# EAGLE design four-step-octaved (EAGLE 9.6.2)
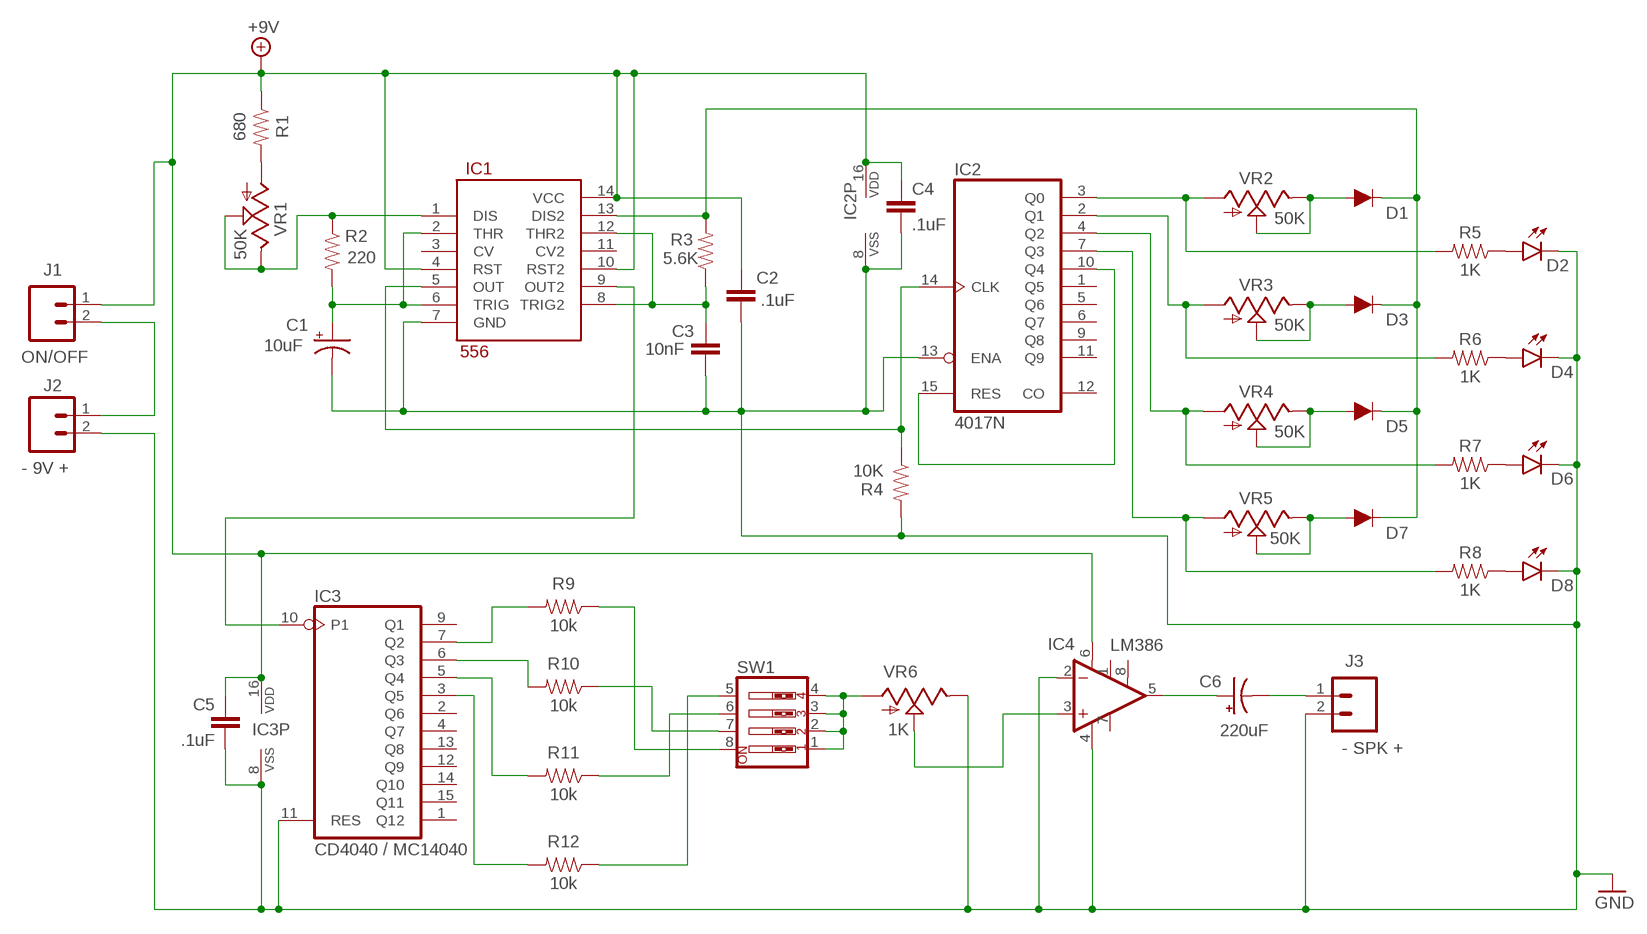
[diagram p0: schematic, sheet 1]

## Parts
C1  10uF  10UF-POLAR-RADIAL-2.5MM-25V-20%  [CPOL-RADIAL-2.5MM-5MM]
C2  .1uF  0.1UF-KIT-EZ-50V-20%  [CAP-PTH-SMALL-KIT]
C3  10nF  0.1UF-KIT-EZ-50V-20%  [CAP-PTH-SMALL-KIT]
C4  .1uF  0.1UF-KIT-EZ-50V-20%  [CAP-PTH-SMALL-KIT]
C5  .1uF  0.1UF-KIT-EZ-50V-20%  [CAP-PTH-SMALL-KIT]
C6  220uF  10UF-POLAR-RADIAL-2.5MM-25V-20%  [CPOL-RADIAL-2.5MM-5MM]
D1  DIODE-PTH  [DIODE-1N4001]
D2  LED3MM  [LED_3MM]
D3  DIODE-PTH  [DIODE-1N4001]
D4  LED3MM  [LED_3MM]
D5  DIODE-PTH  [DIODE-1N4001]
D6  LED3MM  [LED_3MM]
D7  DIODE-PTH  [DIODE-1N4001]
D8  LED3MM  [LED_3MM]
IC1  556  [DIP14]
IC2  4017N  [DIL16]
IC3  CD4040 / MC14040  4040N  [DIL16]
IC4  LM386  [DIP08]
J1  ON/OFF  CONN_02  [1X02]
J2  - 9V +  CONN_02  [1X02]
J3  - SPK +  CONN_02  [1X02]
R1  680  1KOHM-HORIZ-1/4W-1%  [AXIAL-0.3]
R2  220  1KOHM-HORIZ-1/4W-1%  [AXIAL-0.3]
R3  5.6K  1KOHM-HORIZ-1/4W-1%  [AXIAL-0.3]
R4  10K  1KOHM-HORIZ-1/4W-1%  [AXIAL-0.3]
R5  1K  1KOHM-HORIZ-1/4W-1%  [AXIAL-0.3]
R6  1K  1KOHM-HORIZ-1/4W-1%  [AXIAL-0.3]
R7  1K  1KOHM-HORIZ-1/4W-1%  [AXIAL-0.3]
R8  1K  1KOHM-HORIZ-1/4W-1%  [AXIAL-0.3]
R9  10k  1KOHM-HORIZ-1/4W-1%  [AXIAL-0.3]
R10  10k  1KOHM-HORIZ-1/4W-1%  [AXIAL-0.3]
R11  10k  1KOHM-HORIZ-1/4W-1%  [AXIAL-0.3]
R12  10k  1KOHM-HORIZ-1/4W-1%  [AXIAL-0.3]
SW1  SW_DIP-4  [EDG-04]
VR1  50K  POTTRIM  [TRIM_POT]
VR2  50K  POTTRIM  [TRIM_POT]
VR3  50K  POTTRIM  [TRIM_POT]
VR4  50K  POTTRIM  [TRIM_POT]
VR5  50K  POTTRIM  [TRIM_POT]
VR6  1K  POTTRIM  [TRIM_POT]

## Nets
+9V [supply]: C2.1 C4.1 C5.1 IC1.4(RST) IC1.10(RST2) IC1.14(VCC) IC2.16(VDD) IC3.16(VDD) IC4.6(V+) J1.1 R1.P$1
GND [supply]: C1.2(-) C2.2 C3.2 C4.2 C5.2 D2.K(C) D4.K(C) D6.K(C) D8.K(C) IC1.7(GND) IC2.8(VSS) IC2.13(ENA) IC3.8(VSS) IC3.11(RES) IC4.2(-IN) IC4.4(V-) J2.2 J3.2 R4.P$2 VR6.2(E)
N$1 [new default]: R1.P$2 VR1.3(A)
N$2 [new default]: IC1.1(DIS) R2.P$1 VR1.1(S) VR1.2(E)
N$3 [new default]: C1.1(+) IC1.2(THR) IC1.6(TRIG) R2.P$2
N$4 [new default]: IC2.10(Q4) IC2.15(RES)
N$5 [new default]: IC1.5(OUT) IC2.14(CLK) R4.P$1
N$6 [new default]: C3.1 IC1.8(TRIG2) IC1.12(THR2) R3.P$1
N$7 [new default]: IC2.3(Q0) R5.P$2 VR2.3(A)
N$8 [new default]: IC2.2(Q1) R6.P$2 VR3.3(A)
N$9 [new default]: IC2.4(Q2) R7.P$2 VR4.3(A)
N$10 [new default]: IC2.7(Q3) R8.P$2 VR5.3(A)
N$11 [new default]: D1.A VR2.1(S) VR2.2(E)
N$12 [new default]: D8.A R8.P$1
N$13 [new default]: D6.A R7.P$1
N$14 [new default]: D4.A R6.P$1
N$15 [new default]: D2.A R5.P$1
N$16 [new default]: D3.A VR3.1(S) VR3.2(E)
N$17 [new default]: D5.A VR4.1(S) VR4.2(E)
N$18 [new default]: D7.A VR5.1(S) VR5.2(E)
N$19 [new default]: D1.C D3.C D5.C D7.C IC1.13(DIS2) R3.P$2
N$20 [new default]: IC3.7(Q2) R9.P$2
N$21: IC3.5(Q4) R11.P$2
N$22 [new default]: IC3.6(Q3) R10.P$2
N$23: R12.P$1 SW1.5
N$24 [new default]: IC4.3(+IN) VR6.1(S)
N$25: IC3.3(Q5) R12.P$2
N$26: R11.P$1 SW1.6
N$27 [new default]: C6.2(-) J3.1
N$28 [new default]: C6.1(+) IC4.5(OUT)
N$29: R10.P$1 SW1.7
N$30: R9.P$1 SW1.8
N$31: SW1.1 SW1.2 SW1.3 SW1.4 VR6.3(A)
N$32: J1.2 J2.1
N$43 [new default]: IC1.9(OUT2) IC3.10(P1)
Unconnected: IC1.3(CV) IC1.11(CV2) IC2.1(Q5) IC2.5(Q6) IC2.6(Q7) IC2.9(Q8) IC2.11(Q9) IC2.12(CO) IC3.1(Q12) IC3.2(Q6) IC3.4(Q7) IC3.9(Q1) IC3.12(Q9) IC3.13(Q8) IC3.14(Q10) IC3.15(Q11) IC4.1(GAIN) IC4.7(BP) IC4.8(GAIN)

## Library data of the parts
C1 = SparkFun-Capacitors:10UF-POLAR: 10.0µF polarized capacitors A capacitor is a passive two-terminal electrical component used to store electrical energy temporarily in an electric field.; PROD_ID: CAP-08440
C2-C5 = SparkFun-Capacitors:0.1UF: 0.1µF ceramic capacitors A capacitor is a passive two-terminal electrical component used to store electrical energy temporarily in an electric field.; PROD_ID: CAP-08370; VALUE: 0.1uF
C6 = SparkFun-Capacitors:10UF-POLAR: 10.0µF polarized capacitors A capacitor is a passive two-terminal electrical component used to store electrical energy temporarily in an electric field.; PROD_ID: CAP-08440; VALUE: 10uF
D1 D3 D5 D7 = SparkFun-DiscreteSemi:DIODE: Diode These are standard reverse protection diodes and small signal diodes. SparkFun Products: SparkFun SparkPunk Sound Kit <https://www.sparkfun.com/products/11177> SparkFun ESP8266 Thing <https://www.sparkfun.com/products/13231>; PROD_ID: DIO-09176; VALUE: 1A/50V/1.1V
D2 D4 D6 D8 = SparkFun-LED:LED: LED (Generic) Standard schematic elements and footprints for 5mm, 3mm, 1206, and 0603 sized LEDs. Generic LEDs with no color specified.; PROD_ID: DIO-08794
IC1 = SparkFun-IC-Special-Function:556: 556 Dual 555 timer 2 555 timers in one package 1MHZ 14DIP Datasheet <https://cdn.sparkfun.com/datasheets/Kits/icm7555-56.pdf> SparkFun Products SparkFun SparkPunk Sound Kit <https://www.sparkfun.com/products/11177> (KIT-11177); PROD_ID: IC-11898
IC2 = 40xx:4017: COUNTER/DIVIDER
IC3 = 40xx:4040: 12-stage binary/ripple COUNTER
IC4 = SparkFun-IC-Amplifiers:LM386: low voltage audio power amplifier SparkFun Products FabFM Radio Kit <https://www.sparkfun.com/products/11043> (KIT-11043); PROD_ID: IC-10899; VALUE: LM386N
J1-J3 = SparkFun-Connectors:CONN_02: Multi connection point. Often used as Generic Header-pin footprint for 0.1 inch spaced/style header connections On any of the 0.1 inch spaced packages, you can populate with these: Break Away Headers - Straight <https://www.sparkfun.com/products/116> (PRT-00116) Break Away Male Headers - Right Angle <https://www.sparkfun.com/products/553> (PRT-00553) Female Headers <https://www.sparkfun.com/products/115> (PRT-00115) Break Away Headers - Machine Pin <https://www.sparkfun.com/products/117> (PRT-00117) Break Away Female Headers - Swiss Machine Pin <https://www.sparkfun.com/products/743> (PRT-00743) For SCREWTERMINALS and SPRING TERMINALS visit here: Screw Terimnals on SparkFun.com <https://www.sparkfun.com/search/results?term=Screw+Terminals> (5mm/3.5mm/2.54mm spacing) This device is also useful as a general connection point to wire up your design to another part of your project. Our various solder wires solder well into these plated through hole pads. Hook-Up Wire - Assortment (Stranded, 22 AWG) <https://www.sparkfun.com/products/11375> (PRT-11375) Hook-Up Wire - Assortment (Solid Core, 22 AWG) <https://www.sparkfun.com/products/11367> (PRT-11367) View the entire wire category on our website here <https://www.sparkfun.com/categories/141> Special notes: Molex polarized connector foot print use with: PRT-08233 with associated crimp pins and housings. 2.54_SCREWTERM for use with PRT-10571. 3.5mm Screw Terminal footprints for PRT-08084 5mm Screw Terminal footprints for use with PRT-08432
R1-R12 = SparkFun-Resistors:1KOHM: 1kΩ resistor A resistor is a passive two-terminal electrical component that implements electrical resistance as a circuit element. Resistors act to reduce current flow, and, at the same time, act to lower voltage levels within circuits. - Wikipedia; PROD_ID: RES-12182; VALUE: 1k
SW1 = special:SW_DIP-4: DIP SWITCH
VR1-VR6 = SparkFun-Retired:POT; PROD_ID: COM-00104

## Net classes
1 new default: width 0.254 mm, clearance 0.254 mm
2 supply: width 0.508 mm, clearance 0.508 mm

## Board
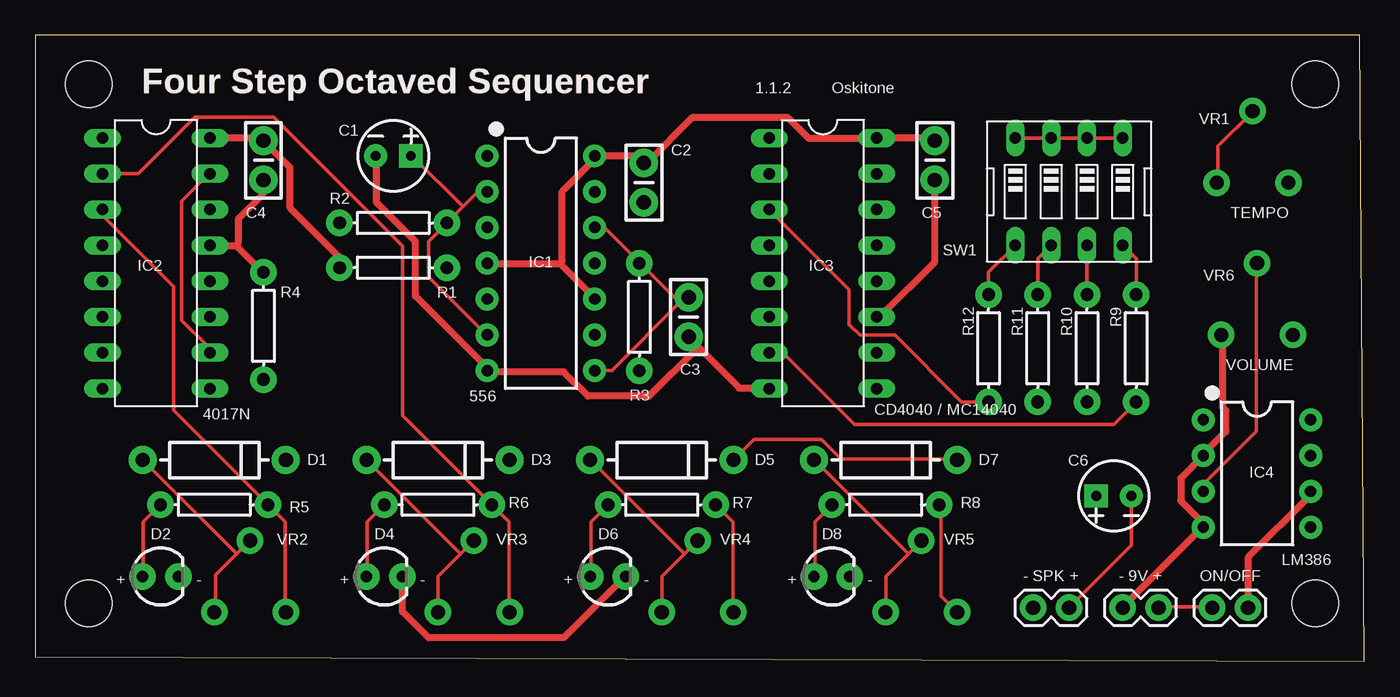
[diagram p1: board, top side]
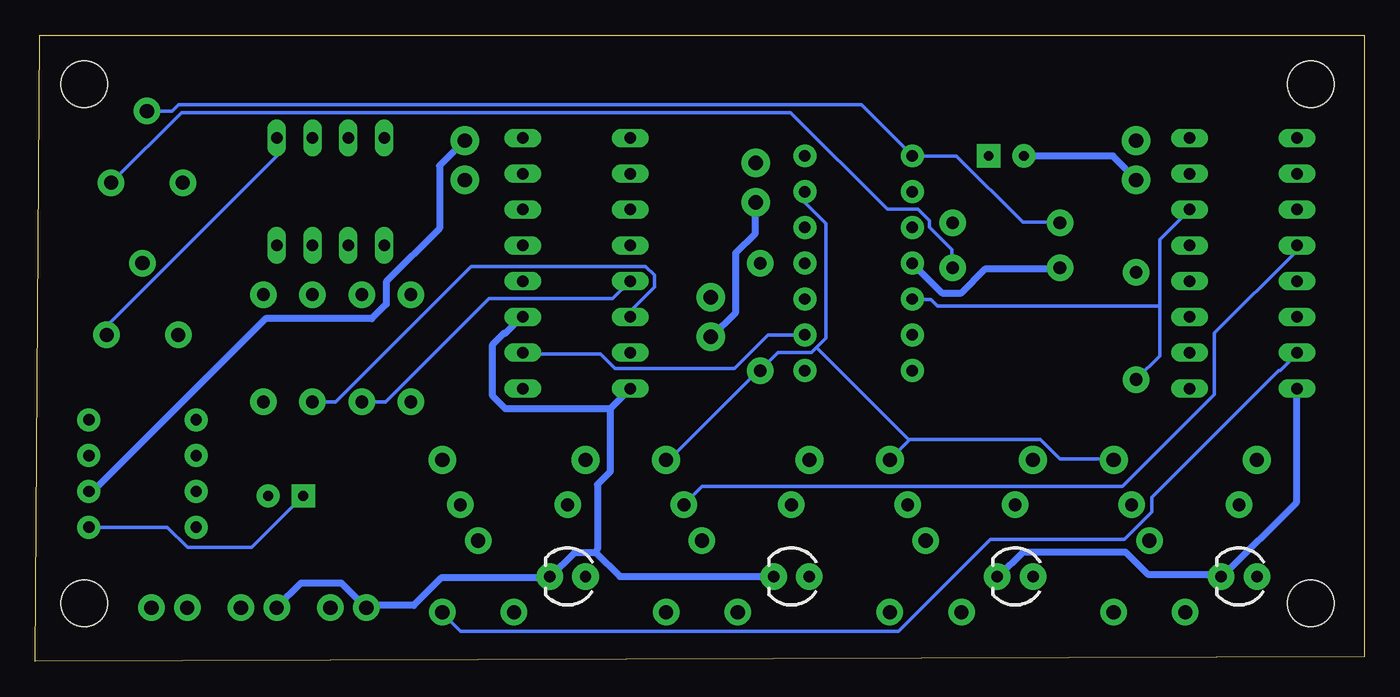
[diagram p2: board, bottom side, seen from below]

Size 94.28 x 44.44 mm. Coordinates in mm from the lower left corner, seen from the top.
Outline: 0,0.32 94.28,0 93.97,44.44 0,44.44 0,0.32
Copper layers (1*16): Top 0.035mm / dielectric 1.5mm / Bottom 0.035mm
Design rules "default": minimum track width 10mil, minimum drill 24mil, track to track 8mil, track to pad 8mil, pad to pad 8mil, via to via 8mil, smd to smd 8mil, copper to edge 40mil, drill to drill 8mil, minimum pad ring 10mil, minimum via ring 8mil, stop-mask expansion 4mil, vias tented up to drill 0mil, thermal gap 10mil
Holes 3.3 mm at 3.81,4.13 90.81,4.13 90.81,40.96 3.81,40.96

### Footprints (pad centres in the part's own frame; a part is rotated, then mirrored left to right if it is on the bottom)
CPOL-RADIAL-2.5MM-5MM = drill 0.7 pad 1.651 square: 1 1.25,0 | drill 0.7 pad 1.651: 2 -1.25,0
CAP-PTH-SMALL-KIT = drill 1.016 pad 2.032: 1 -1.397,0; 2 1.397,0
DIODE-1N4001 = drill 1 pad 1.981: A -5.08,0; C 5.08,0
LED_3MM = drill 0.813 pad 1.88: A -1.27,0; K 1.27,0
DIP14 = drill 0.813 pad 1.626: 1 -7.62,-3.81; 2 -5.08,-3.81; 3 -2.54,-3.81; 4 0,-3.81; 5 2.54,-3.81; 6 5.08,-3.81; 7 7.62,-3.81; 8 7.62,3.81; 9 5.08,3.81; 10 2.54,3.81; 11 0,3.81; 12 -2.54,3.81; 13 -5.08,3.81; 14 -7.62,3.81
DIL16 = drill 0.813 long: 1 -8.89,-3.81; 2 -6.35,-3.81; 3 -3.81,-3.81; 4 -1.27,-3.81; 5 1.27,-3.81; 6 3.81,-3.81; 7 6.35,-3.81; 8 8.89,-3.81; 9 8.89,3.81; 10 6.35,3.81; 11 3.81,3.81; 12 1.27,3.81; 13 -1.27,3.81; 14 -3.81,3.81; 15 -6.35,3.81; 16 -8.89,3.81
DIP08 = drill 0.813 pad 1.626: 1 -3.81,-3.81; 2 -1.27,-3.81; 3 1.27,-3.81; 4 3.81,-3.81; 5 3.81,3.81; 6 1.27,3.81; 7 -1.27,3.81; 8 -3.81,3.81
1X02 = drill 1.016 pad 1.88: 1 0,0; 2 2.54,0
AXIAL-0.3 = drill 0.9 pad 1.88: P$1 -3.81,0; P$2 3.81,0
EDG-04 = drill 0.813 long: 1 -3.81,-3.81; 2 -1.27,-3.81; 3 1.27,-3.81; 4 3.81,-3.81; 5 3.81,3.81; 6 1.27,3.81; 7 -1.27,3.81; 8 -3.81,3.81
TRIM_POT = drill 1 pad 1.88: 1 5.08,0; 2 0,2.54; 3 0,-2.54

### Placement (x,y rotation side)
C1  25.4,35.88 0 top
C2  43.18,33.97 270 top
C3  46.35,24.45 270 top
C4  16.19,35.56 270 top
C5  63.82,35.56 270 top
C6  76.52,11.75 180 top
D1  12.7,14.29 0 top
D2  8.89,6.03 0 top
D3  28.57,14.29 0 top
D4  24.77,6.03 0 top
D5  44.45,14.29 0 top
D6  40.64,6.03 0 top
D7  60.33,14.29 0 top
D8  56.52,6.03 0 top
IC1  35.88,28.26 270 top
IC2  8.57,28.26 270 top
IC3  55.88,28.26 270 top
IC4  86.68,13.34 270 top
J1  86.04,3.81 180 top
J2  79.69,3.81 180 top
J3  73.34,3.81 180 top
R1  25.4,27.94 0 top
R2  25.4,31.11 0 top
R3  42.86,24.45 270 top
R4  16.19,23.81 90 top
R5  12.7,11.11 0 top
R6  28.57,11.11 0 top
R7  44.45,11.11 0 top
R8  60.33,11.11 0 top
R9  78.11,22.22 270 top
R10  74.61,22.22 270 top
R11  71.12,22.22 270 top
R12  67.63,22.22 270 top
SW1  73.34,33.34 180 top
VR1  86.36,33.97 90 top
VR2  15.24,3.49 90 top
VR3  31.11,3.49 90 top
VR4  46.99,3.49 90 top
VR5  62.87,3.49 90 top
VR6  86.68,23.18 90 top

### Tracks (layer width: path | path; a pad name or v marks a point on that pad's centre or on a via)
+9V
  Top 0.508: IC2.16 12.46,37.12 16,37.12 16.12,37.01 C4.1 16.34,36.78 18.06,35.06 18.06,32.21 21.49,28.78 21.49,27.98 R1.P$1 | IC4.6 90.41,11.98 90.41,11.75 86.07,7.4 86.07,3.86 J1.1 | C5.1 63.78,37.01 63.66,37.12 59.78,37.12 IC3.16 59.44,37.12 54.86,37.12 53.38,38.61 46.63,38.61 43.43,35.41 C2.1 43.09,35.41 42.63,35.86 39.78,35.86 IC1.14 39.66,35.64 37.38,33.35 37.38,28.44 37.26,28.21 | 37.26,28.21 32.12,28.21 IC1.4 | 37.26,28.21 39.66,25.81 IC1.10
  Bottom 0.508: IC4.6 90.41,12.09 90.18,12.09 77.95,24.32 70.41,24.32 69.38,25.35 69.38,26.95 65.61,30.72 65.61,35.18 63.89,36.89 C5.1 | R1.P$1 21.6,27.86 26.86,27.86 28.57,26.15 29.95,26.15 32,28.21 IC1.4
GND
  Top 0.508: VR6.2 84.24,23.18 84.24,18.03 84.47,17.81 84.47,16.32 82.98,14.83 IC4.2 81.27,13 81.27,11.4 82.87,9.8 IC4.4 82.75,9.46 77.15,3.86 J2.2 | 14.29,29.46 12.46,29.46 IC2.13 | 14.29,29.46 16.12,27.64 R4.P$2 | 14.29,29.46 14.4,29.69 14.4,31.41 16.12,33.12 16.12,34.15 C4.2 | IC3.11 59.78,24.55 60.01,24.55 63.78,28.32 63.78,34.15 C5.2 | IC3.8 52.01,19.41 49.95,19.41 46.41,22.95 C3.2 46.86,22.15 43.55,18.83 39.2,18.83 37.49,20.55 32.12,20.55 IC1.7 32,20.89 26.98,25.92 26.98,29.81 24.23,32.55 24.23,35.86 C1.2 | D4.K 26.06,6.03 26.06,3.52 27.89,1.69 37.49,1.69 41.83,6.03 D6.K
  Bottom 0.508: IC2.8 4.8,19.29 4.8,11.29 10.06,6.03 D2.K 10.4,6.15 15.32,6.15 16.92,7.75 24.23,7.75 25.95,6.03 D4.K | J2.2 77.15,3.86 75.44,5.58 72.58,5.58 70.87,3.86 J3.2 70.64,3.98 67.44,3.98 65.49,5.92 57.95,5.92 D8.K 57.72,6.03 56.01,7.75 54.52,7.75 | C1.2 24.12,35.86 17.83,35.86 16.23,34.26 C4.2 | D6.K 52.81,6.03 54.52,7.75 | C2.2 43.2,32.55 43.2,30.38 44.58,29.01 44.58,24.78 46.29,23.06 C3.2 | 53.49,17.92 60.92,17.92 61.84,18.83 61.84,22.49 61.04,23.29 60.92,23.29 59.78,24.43 IC3.11 | 53.49,17.92 52.12,19.29 IC3.8 | 53.49,17.92 53.49,13.46 54.41,12.55 54.41,7.98 54.52,7.75
N$1
  Bottom 0.254: R1.P$2 29.26,27.98 29.26,29.24 30.86,30.84 30.86,31.29 31.66,32.09 33.83,32.09 40.69,38.95 83.9,38.95 88.81,34.04 VR1.3
N$2
  Top 0.254: VR1.2 83.9,34.04 83.9,36.55 86.3,38.95 VR1.1
  Bottom 0.254: R2.P$1 21.6,31.18 24.23,31.18 28.92,35.86 32,35.86 IC1.1 32.12,35.98 35.66,39.52 84.12,39.52 84.58,39.07 86.3,39.07 VR1.1
N$3
  Top 0.254: IC1.6 32,23.18 27.89,27.29 27.89,29.81 29.15,31.06 R2.P$2 29.26,31.18 30.35,32.26 | 30.35,32.26 31.32,33.24 32,33.24 IC1.2 | 30.35,32.26 26.75,35.86 C1.1
N$4
  Top 0.254: IC2.10 12.34,21.92 12.34,22.26 10.4,24.21 10.4,32.66 12.34,34.61 IC2.15
N$5
  Bottom 0.254: 14.52,25.23 14.52,21.69 16.12,20.09 R4.P$1 | 14.52,25.23 14.52,29.92 12.46,31.98 IC2.14 | 14.52,25.23 30.29,25.23 30.75,25.69 32,25.69 IC1.5
N$6
  Top 0.254: IC1.12 39.78,30.72 40.46,30.72 42.86,28.32 R3.P$1 42.98,28.21 45.72,25.46 | 45.72,25.46 46.06,25.81 46.29,25.81 C3.1 45.72,25.46 | 45.72,25.46 40.92,20.66 39.78,20.66 IC1.8
N$7
  Top 0.254: IC2.3 4.8,31.98 4.8,31.64 9.83,26.61 9.83,17.81 16.46,11.18 R5.P$2 16.57,11.06 17.72,9.92 17.72,3.52 VR2.3
N$8
  Top 0.254: IC2.2 7.32,34.61 11.32,38.61 16.92,38.61 26.06,29.46 26.06,17.46 32.35,11.18 R6.P$2 32.46,11.06 33.6,9.92 33.6,3.52 VR3.3
N$9
  Top 0.254: VR4.3 49.49,3.52 49.49,9.92 48.35,11.06 R7.P$2
  Bottom 0.254: IC2.4 4.8,29.46 4.8,29.12 10.63,23.29 10.63,18.95 17.14,12.43 46.98,12.43 48.23,11.18 R7.P$2
N$10
  Top 0.254: VR5.3 64.24,4.66 64.24,11.06 R8.P$2
  Bottom 0.254: IC2.7 4.8,21.81 5.94,20.66 6.06,20.66 15.09,11.63 15.09,10.6 17.03,8.66 26.52,8.66 33.03,2.15 64.12,2.15 65.38,3.4 VR5.3
N$11
  Top 0.254: 14.29,7.63 15.2,8.55 VR2.1 | 14.29,7.63 12.8,6.15 12.8,3.52 VR2.2 | 14.29,7.63 7.66,14.26 D1.A
N$12
  Top 0.254: R8.P$1 55.32,9.92 55.32,6.03 D8.A
N$13
  Top 0.254: D6.A 39.43,6.03 39.43,9.92 40.58,11.06 R7.P$1
N$14
  Top 0.254: D4.A 23.55,6.03 23.55,9.92 24.69,11.06 R6.P$1
N$15
  Top 0.254: D2.A 7.66,6.03 7.66,9.92 8.8,11.06 R5.P$1
N$16
  Top 0.254: VR3.2 28.57,6.03 30.18,7.63 | VR3.1 30.18,7.63 | 30.18,7.63 23.55,14.26 D3.A
N$17
  Top 0.254: 46.06,7.63 46.98,8.55 VR4.1 | 46.06,7.63 44.46,6.03 44.46,3.52 VR4.2 | 46.06,7.63 39.43,14.26 D5.A
N$18
  Top 0.254: 61.95,7.63 62.87,8.55 VR5.1 | 61.95,7.63 60.35,6.03 60.35,3.52 VR5.2 | 61.95,7.63 55.32,14.26 D7.A
N$19
  Top 0.254: D7.C 65.38,14.38 57.15,14.38 55.78,15.75 50.98,15.75 49.61,14.38 D5.C
  Bottom 0.254: 32.23,15.75 22.97,15.75 21.6,14.38 17.83,14.38 D1.C | 32.23,15.75 33.6,14.38 D3.C | 38.86,22.26 39.2,21.92 41.6,21.92 42.86,20.66 R3.P$2 42.98,20.66 49.26,14.38 49.49,14.38 D5.C | 38.86,22.26 38.18,22.95 38.18,31.06 39.66,32.55 39.66,33.24 IC1.13 | 38.86,22.26 32.35,15.75 32.23,15.75
N$20
  Top 0.254: R9.P$2 76.52,16.83 58.1,16.83 53.02,21.91 IC3.7
N$21
  Bottom 0.254: R11.P$2 69.42,18.42 62.1,25.74 53.31,25.74 IC3.5
N$22
  Bottom 0.254: R10.P$2 72.99,18.42 63.37,28.03 50.98,28.03 50.37,27.42 50.37,26.56 52.07,24.85 IC3.6
N$23
  Top 0.254: SW1.5 67.63,27.62 R12.P$1
N$24
  Top 0.254: IC4.3 82.87,12.55 86.64,16.32 86.64,28.21 VR6.1
N$25
  Top 0.254: R12.P$2 65.72,18.42 60.98,23.15 58.49,23.15 57.73,23.91 57.73,26.4 IC3.3
N$26
  Top 0.254: SW1.6 71.12,28.58 R11.P$1
N$27
  Top 0.254: J3.1 77.77,8.24 C6.2
N$28
  Bottom 0.254: IC4.5 84.92,9.52 83.47,8.08 78.94,8.08 C6.1
N$29
  Top 0.254: SW1.7 R10.P$1
N$30
  Top 0.254: SW1.8 78.11,28.58 R9.P$1
N$31
  Top 0.254: SW1.4 69.61,37.12 72.01,37.12 SW1.3 72.12,37.12 74.52,37.12 SW1.2 74.64,37.12 77.15,37.12 SW1.1
  Bottom 0.254: SW1.1 77.15,35.86 89.15,23.86 89.15,23.18 VR6.3
N$32
  Top 0.254: J2.1 79.78,3.86 83.44,3.86 J1.2
N$43
  Bottom 0.254: IC1.9 42.29,23.18 44.69,20.78 53.15,20.78 54.18,21.81 59.66,21.81 IC3.10

### Text on the board
Top: Four Step Octaved Sequencer
tPlace: Four Step Octaved Sequencer | 1.1.2 | Oskitone | VR1 | C2 | C4 | C5 | TEMPO | VR6 | C3 | VOLUME | VR2 | VR3 | VR4 | VR5 | + | - | + | - | + | - | + | -